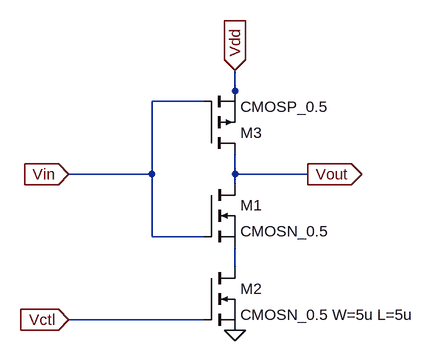
[diagram p0: schematic s_starv_current_inv.asc]
s_starv_current_inv.asc, the LTspice schematic file:
Version 4
SHEET 1 880 680
WIRE 176 -16 176 -48
WIRE 128 0 48 0
WIRE 176 0 176 -16
WIRE 48 112 48 0
WIRE 48 112 -80 112
WIRE 176 112 176 80
WIRE 288 112 176 112
WIRE 176 128 176 112
WIRE 48 208 48 112
WIRE 128 208 48 208
WIRE 176 256 176 224
WIRE 128 336 -80 336
FLAG 176 352 0
FLAG -80 336 Vctl
IOPIN -80 336 In
FLAG -80 112 Vin
IOPIN -80 112 In
FLAG 288 112 Vout
IOPIN 288 112 Out
FLAG 176 -48 Vdd
IOPIN 176 -48 In
SYMBOL nmos 128 128 R0
SYMATTR InstName M1
SYMATTR Value CMOSN_0.5
SYMBOL nmos 128 256 R0
SYMATTR InstName M2
SYMATTR Value CMOSN_0.5 W=5u L=5u
SYMBOL pmos 128 80 M180
SYMATTR InstName M3
SYMATTR Value CMOSP_0.5

The netlist it stands for:
* s_starv_current_inv.asc
M1 Vout Vin N001 N001 CMOSN_0.5
M2 N001 Vctl 0 0 CMOSN_0.5 W=5u L=5u
M3 Vout Vin Vdd Vdd CMOSP_0.5
.model NMOS NMOS
.model PMOS PMOS
.lib standard.mos
.backanno
.end